# EAGLE design G503 (EAGLE 6.6.0)

## Sheet 1 of 2
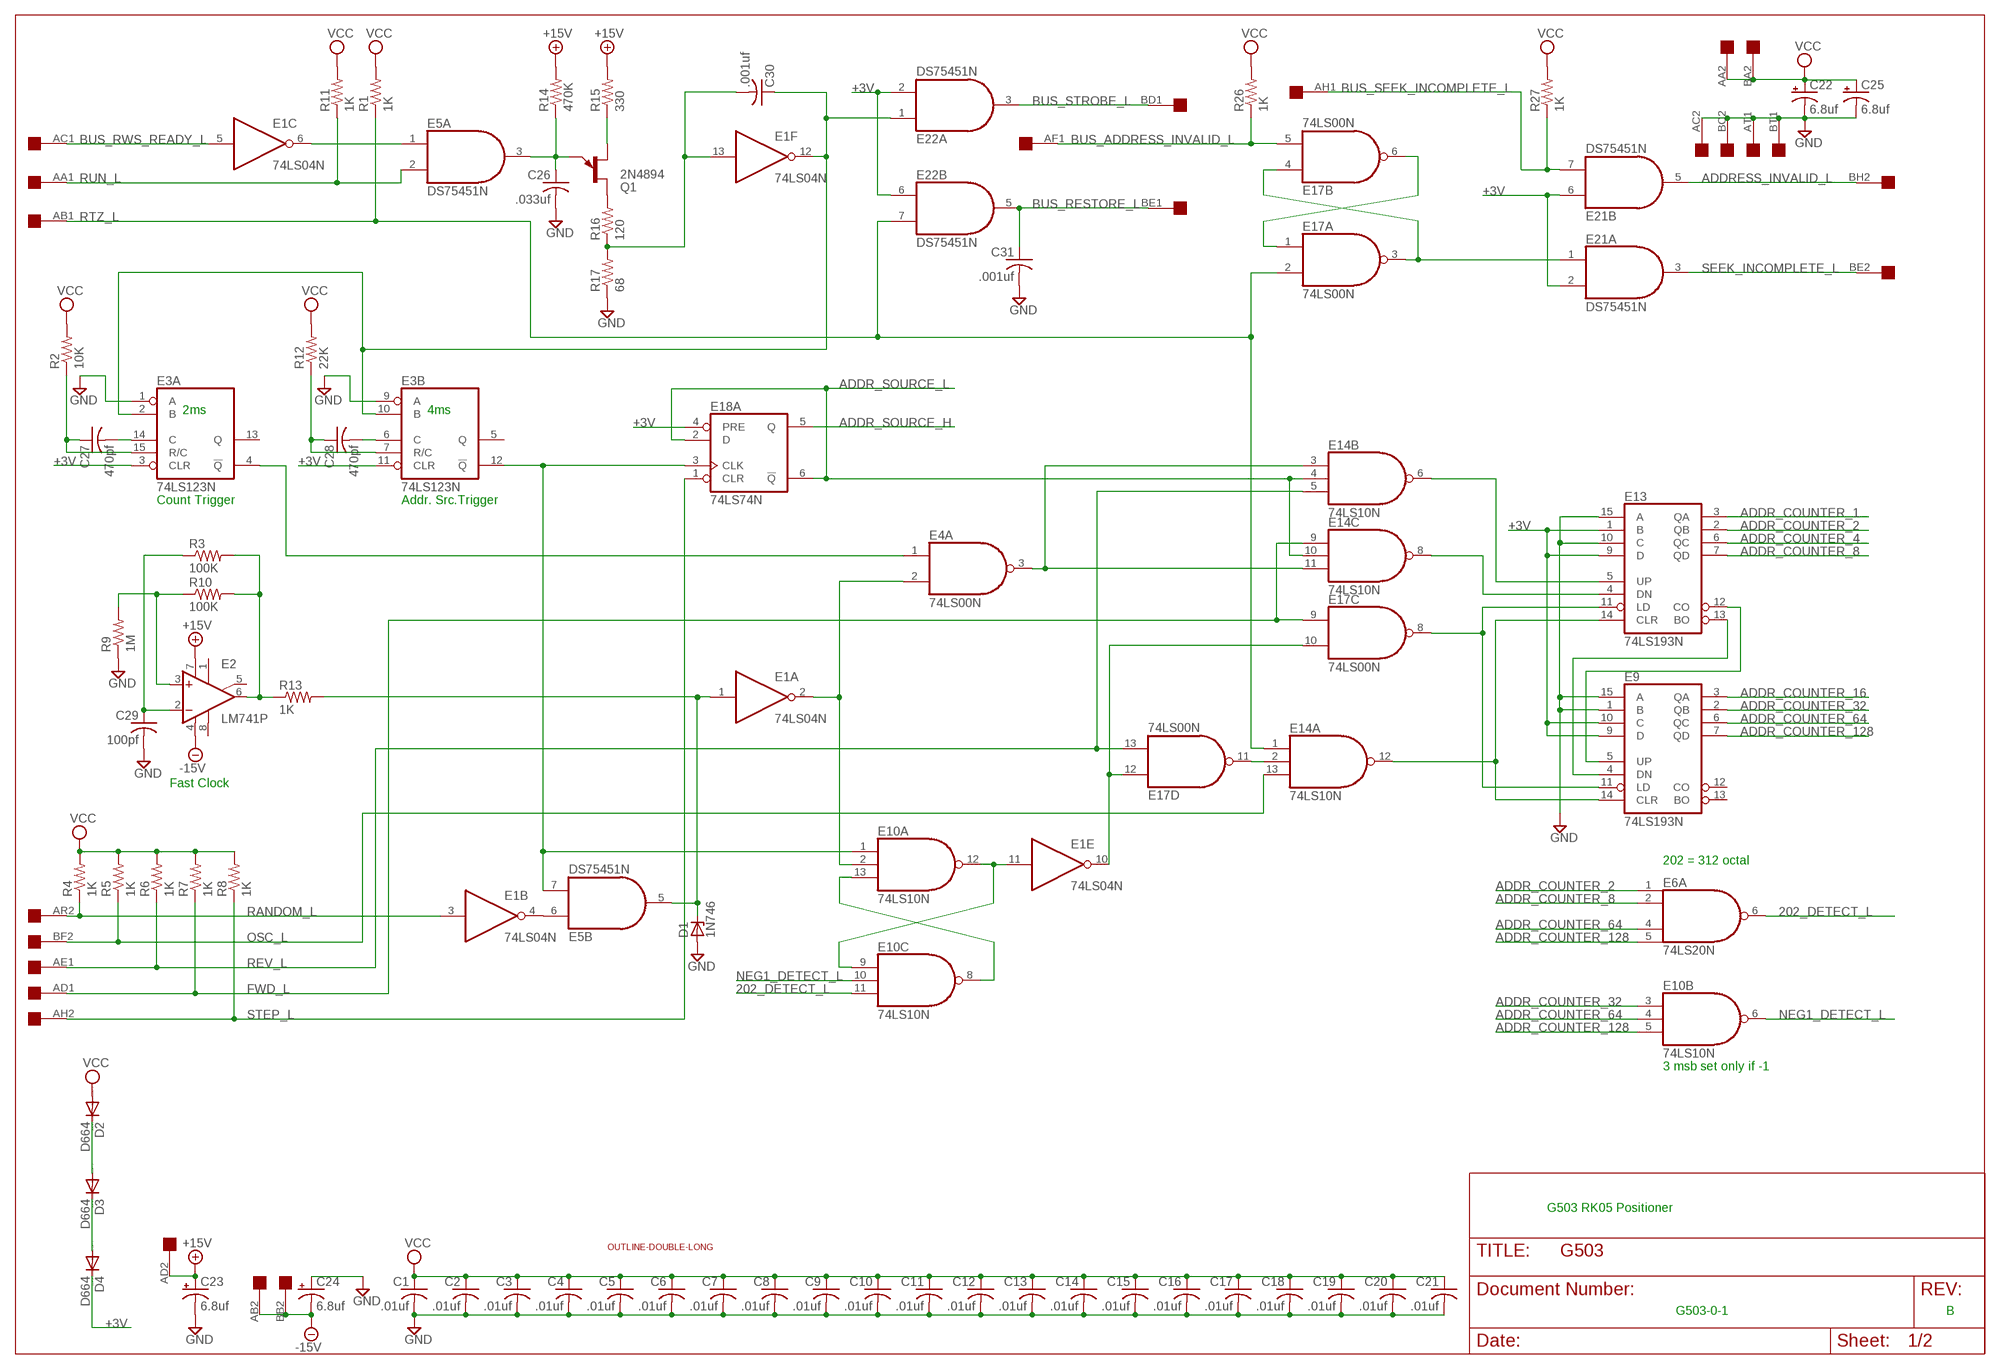
[diagram p0: schematic, sheet 1]

### Parts
AB03  DOUBLE  [EDGE-CON4]
C1  .01uf  C-US075-032X103  [C075-032X103]
C2  .01uf  C-US075-032X103  [C075-032X103]
C3  .01uf  C-US075-032X103  [C075-032X103]
C4  .01uf  C-US075-032X103  [C075-032X103]
C5  .01uf  C-US075-032X103  [C075-032X103]
C6  .01uf  C-US075-032X103  [C075-032X103]
C7  .01uf  C-US075-032X103  [C075-032X103]
C8  .01uf  C-US075-032X103  [C075-032X103]
C9  .01uf  C-US075-032X103  [C075-032X103]
C10  .01uf  C-US075-032X103  [C075-032X103]
C11  .01uf  C-US075-032X103  [C075-032X103]
C12  .01uf  C-US075-032X103  [C075-032X103]
C13  .01uf  C-US075-032X103  [C075-032X103]
C14  .01uf  C-US075-032X103  [C075-032X103]
C15  .01uf  C-US075-032X103  [C075-032X103]
C16  .01uf  C-US075-032X103  [C075-032X103]
C17  .01uf  C-US075-032X103  [C075-032X103]
C18  .01uf  C-US075-032X103  [C075-032X103]
C19  .01uf  C-US075-032X103  [C075-032X103]
C20  .01uf  C-US075-032X103  [C075-032X103]
C21  .01uf  C-US075-032X103  [C075-032X103]
C22  6.8uf  CPOL-USE25-9AXIAL  [E25-9]
C23  6.8uf  CPOL-USE25-9AXIAL  [E25-9]
C24  6.8uf  CPOL-USE25-9AXIAL  [E25-9]
C25  6.8uf  CPOL-USE25-9AXIAL  [E25-9]
C26  .033uf  C-US075-032X103  [C075-032X103]
C27  470pf  C-US075-032X103  [C075-032X103]
C28  470pf  C-US075-032X103  [C075-032X103]
C29  100pf  C-US075-032X103  [C075-032X103]
C30  .001uf  C-US075-032X103  [C075-032X103]
C31  .001uf  C-US075-032X103  [C075-032X103]
D1  1N746  ZENER-DIODEDO35Z10  [DO35Z10]
D2  D664  1N4148DO35-10  [DO35-10]
D3  D664  1N4148DO35-10  [DO35-10]
D4  D664  1N4148DO35-10  [DO35-10]
E1  74LS04N  [DIL14]
E2  LM741P  [DIL08]
E3  74LS123N  [DIL16]
E4  74LS00N  [DIL14]
E5  DS75451N  [DIL08]
E6  74LS20N  [DIL14]
E9  74LS193N  [DIL16]
E10  74LS10N  74AS10N  [DIL14]
E13  74LS193N  [DIL16]
E14  74LS10N  74AS10N  [DIL14]
E17  74LS00N  [DIL14]
E18  74LS74N  [DIL14]
E21  DS75451N  [DIL08]
E22  DS75451N  [DIL08]
Q1  2N4894  2N4870  [TO92E]
R1  1K  R-US_0207/10  [0207/10]
R2  10K  R-US_0207/10  [0207/10]
R3  100K  R-US_0207/10  [0207/10]
R4  1K  R-US_0207/10  [0207/10]
R5  1K  R-US_0207/10  [0207/10]
R6  1K  R-US_0207/10  [0207/10]
R7  1K  R-US_0207/10  [0207/10]
R8  1K  R-US_0207/10  [0207/10]
R9  1M  R-US_0207/10  [0207/10]
R10  100K  R-US_0207/10  [0207/10]
R11  1K  R-US_0207/10  [0207/10]
R12  22K  R-US_0207/10  [0207/10]
R13  1K  R-US_0207/10  [0207/10]
R14  470K  R-US_0207/10  [0207/10]
R15  330  R-US_0207/10  [0207/10]
R16  120  R-US_0207/10  [0207/10]
R17  68  R-US_0207/10  [0207/10]
R26  1K  R-US_0207/10  [0207/10]
R27  1K  R-US_0207/10  [0207/10]
U$1  OUTLINE-DOUBLE-LONG  [DOUBLE-LONG]

### Nets
202_DETECT_L: E6.6(A:O) E10.11(C:I2)
+3V: D4.C E3.3(A:CLR) E3.11(B:CLR) E9.9(D) E9.10(C) E13.1(B) E13.9(D) E18.4(A:PRE) E21.2(A:I1) E21.6(B:I0) E22.2(A:I1) E22.6(B:I0)
+15V: AB03.AD2 C23.+ E2.7(V+) R14.2 R15.2
-15V: AB03.AB2 AB03.BB2 C24.- E2.4(V-)
ADDR_COUNTER_1: E13.3(QA) ; also sheet 2
ADDR_COUNTER_2: E6.1(A:I0) E13.2(QB) ; also sheet 2
ADDR_COUNTER_4: E13.6(QC) ; also sheet 2
ADDR_COUNTER_8: E6.2(A:I1) E13.7(QD) ; also sheet 2
ADDR_COUNTER_16: E9.3(QA) ; also sheet 2
ADDR_COUNTER_32: E9.2(QB) E10.3(B:I0) ; also sheet 2
ADDR_COUNTER_64: E6.4(A:I2) E9.6(QC) E10.4(B:I1) ; also sheet 2
ADDR_COUNTER_128: E6.5(A:I3) E9.7(QD) E10.5(B:I2) ; also sheet 2
ADDR_SOURCE_H: E18.5(A:Q) ; also sheet 2
ADDR_SOURCE_L: E14.4(B:I1) E14.10(C:I1) E18.2(A:D) E18.6(A:!Q) ; also sheet 2
ADDRESS_INVALID_L: AB03.BH2 E21.5(B:O)
BUS_ADDRESS_INVALID_L: AB03.AF1 E17.5(B:I1) R26.1
BUS_RESTORE_L: AB03.BE1 C31.1 E22.5(B:O)
BUS_RWS_READY_L: AB03.AC1 E1.5(C:I)
BUS_SEEK_INCOMPLETE_L: AB03.AH1 E21.7(B:I1) R27.1
BUS_STROBE_L: AB03.BD1 E22.3(A:O)
FWD_L: AB03.AD1 E14.9(C:I0) E17.9(C:I0) R7.1
GND: AB03.AC2 AB03.AT1 AB03.BC2 AB03.BT1 C1.2 C2.2 C3.2 C4.2 C5.2 C6.2 C7.2 C8.2 C9.2 C10.2 C11.2 C12.2 C13.2 C14.2 C15.2 C16.2 C17.2 C18.2 C19.2 C20.2 C21.2 C22.- C23.- C24.+ C25.- C26.2 C29.2 C31.2 D1.A E3.1(A:A) E3.9(B:A) E9.1(B) E9.15(A) E13.10(C) E13.15(A) R9.1 R17.1 ; also sheet 2
N$1: E1.6(C:O) E5.1(A:I0)
N$2: C26.1 E5.3(A:O) Q1.E R14.1
N$3: Q1.B1 R15.1
N$4: Q1.B2 R16.2
N$5: C30.2 E1.13(F:I) R16.1 R17.2
N$6: C30.1 E1.12(F:O) E3.2(A:B) E3.10(B:B) E22.1(A:I0)
N$7: E17.1(A:I0) E17.6(B:O)
N$8: E17.3(A:O) E17.4(B:I0) E21.1(A:I0)
N$9: C27.1 E3.15(A:R/C) R2.1
N$10: C27.2 E3.14(A:C)
N$11: C28.1 E3.7(B:R/C) R12.1
N$12: C28.2 E3.6(B:C)
N$29: E13.5(UP) E14.6(B:O)
N$30: E9.4(DN) E13.13(BO)
N$31: E9.5(UP) E13.12(CO)
N$32: E13.4(DN) E14.8(C:O)
N$33: E9.11(LD) E13.11(LD) E17.8(C:O)
N$34: E9.14(CLR) E13.14(CLR) E14.12(A:O)
N$35: C29.1 E2.2(-IN) R3.1
N$36: E2.6(OUT) R3.2 R10.2 R13.1
N$37: E2.3(+IN) R9.2 R10.1
N$38: D1.C E1.1(A:I) E5.5(B:O) R13.2
N$39: E1.2(A:O) E4.2(A:I1) E10.2(A:I1)
N$40: E3.4(A:!Q) E4.1(A:I0)
N$41: D2.C D3.A
N$42: D3.C D4.A
N$44: E1.4(B:O) E5.6(B:I0)
N$45: E10.8(C:O) E10.13(A:I2)
N$46: E3.12(B:!Q) E5.7(B:I1) E10.1(A:I0) E18.3(A:CLK)
N$47: E4.3(A:O) E14.3(B:I0) E14.11(C:I2)
N$48: E1.11(E:I) E10.9(C:I0) E10.12(A:O)
N$49: E14.2(A:I1) E17.11(D:O)
N$50: E1.10(E:O) E17.10(C:I1) E17.12(D:I0)
NEG1_DETECT_L: E10.6(B:O) E10.10(C:I1)
OSC_L: AB03.BF2 E14.13(A:I2) R5.1
RANDOM_L: AB03.AR2 E1.3(B:I) R4.1
REV_L: AB03.AE1 E14.5(B:I2) E17.13(D:I1) R6.1
RTZ_L: AB03.AB1 E14.1(A:I0) E17.2(A:I1) E22.7(B:I1) R1.1
RUN_L: AB03.AA1 E5.2(A:I1) R11.1
SEEK_INCOMPLETE_L: AB03.BE2 E21.3(A:O)
STEP_L: AB03.AH2 E18.1(A:CLR) R8.1
VCC: AB03.AA2 AB03.BA2 C1.1 C2.1 C3.1 C4.1 C5.1 C6.1 C7.1 C8.1 C9.1 C10.1 C11.1 C12.1 C13.1 C14.1 C15.1 C16.1 C17.1 C18.1 C19.1 C20.1 C21.1 C22.+ C25.+ D2.A R1.2 R2.2 R4.2 R5.2 R6.2 R7.2 R8.2 R11.2 R12.2 R26.2 R27.2 ; also sheet 2
Unconnected: AB03.AE2 AB03.AF2 AB03.AJ1 AB03.AJ2 AB03.AK1 AB03.AK2 AB03.AL2 AB03.AM2 AB03.AN2 AB03.AP2 AB03.AS2 AB03.AT2 AB03.AU2 AB03.AV2 AB03.BA1 AB03.BB1 AB03.BC1 AB03.BD2 AB03.BJ2 AB03.BK2 AB03.BL2 AB03.BM2 AB03.BN2 AB03.BP2 AB03.BR1 AB03.BR2 AB03.BS1 AB03.BS2 AB03.BT2 AB03.BU1 AB03.BU2 AB03.BV1 AB03.BV2 E2.1(ON1) E2.5(ON2) E2.8(OPT) E3.5(B:Q) E3.13(A:Q) E9.12(CO) E9.13(BO)

### Notes on the sheet
- 2ms | 4ms
- Count Trigger | Addr. Src.Trigger
- Fast Clock
- 202 = 312 octal
- 3 msb set only if -1
- G503 RK05 Positioner
- G503-0-1 | B

## Sheet 2 of 2
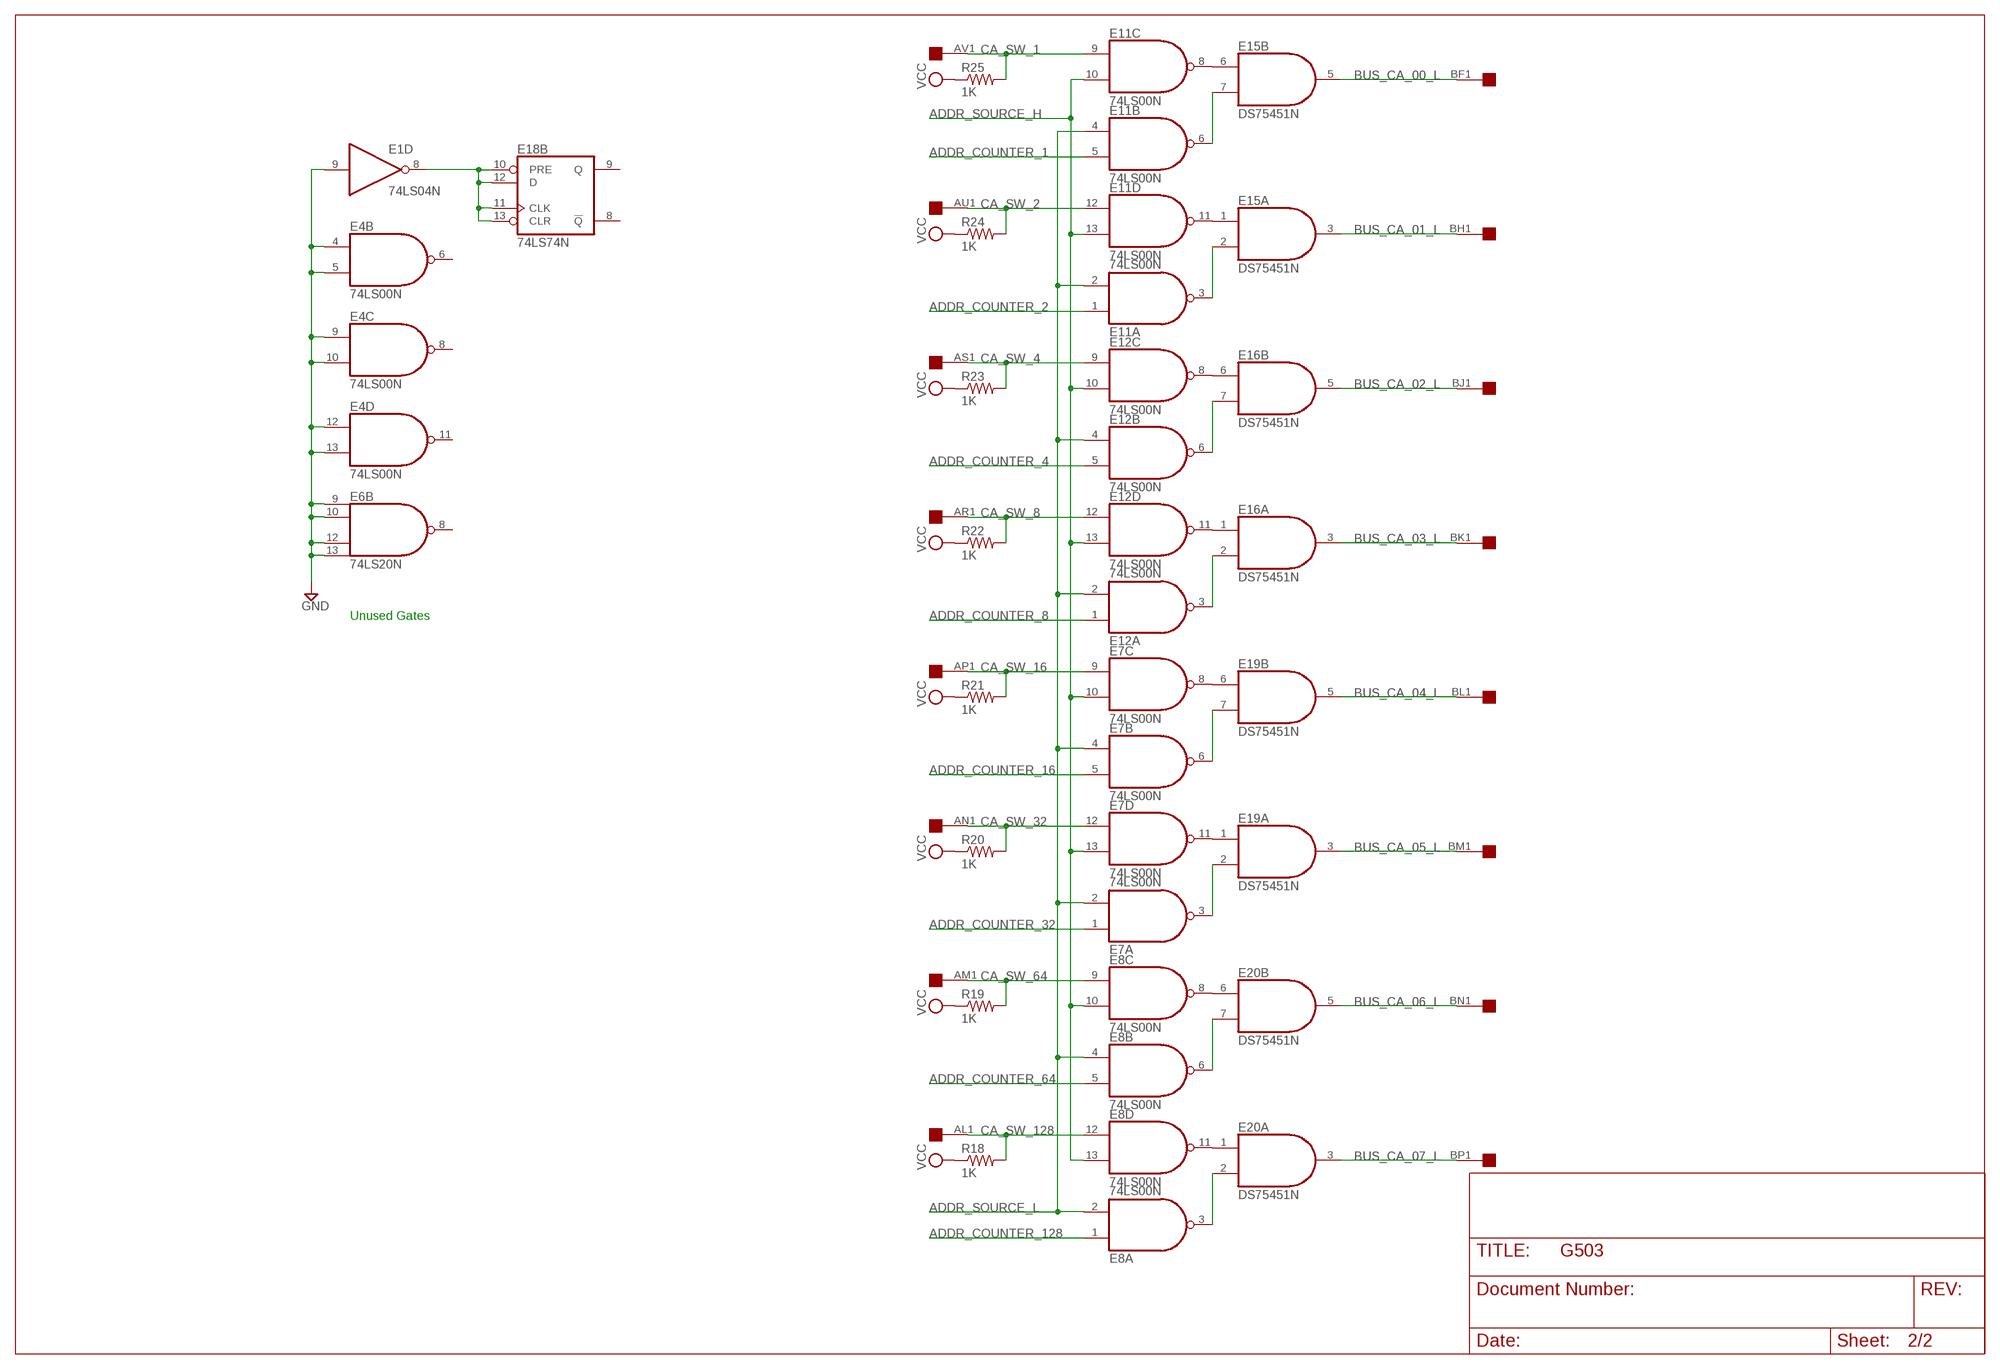
[diagram p1: schematic, sheet 2]

### Parts
E7  74LS00N  [DIL14]
E8  74LS00N  [DIL14]
E11  74LS00N  [DIL14]
E12  74LS00N  [DIL14]
E15  DS75451N  [DIL08]
E16  DS75451N  [DIL08]
E19  DS75451N  [DIL08]
E20  DS75451N  [DIL08]
R18  1K  R-US_0207/10  [0207/10]
R19  1K  R-US_0207/10  [0207/10]
R20  1K  R-US_0207/10  [0207/10]
R21  1K  R-US_0207/10  [0207/10]
R22  1K  R-US_0207/10  [0207/10]
R23  1K  R-US_0207/10  [0207/10]
R24  1K  R-US_0207/10  [0207/10]
R25  1K  R-US_0207/10  [0207/10]

### Nets
ADDR_COUNTER_1: E11.5(B:I1) ; also sheet 1
ADDR_COUNTER_2: E11.1(A:I0) ; also sheet 1
ADDR_COUNTER_4: E12.5(B:I1) ; also sheet 1
ADDR_COUNTER_8: E12.1(A:I0) ; also sheet 1
ADDR_COUNTER_16: E7.5(B:I1) ; also sheet 1
ADDR_COUNTER_32: E7.1(A:I0) ; also sheet 1
ADDR_COUNTER_64: E8.5(B:I1) ; also sheet 1
ADDR_COUNTER_128: E8.1(A:I0) ; also sheet 1
ADDR_SOURCE_H: E7.10(C:I1) E7.13(D:I1) E8.10(C:I1) E8.13(D:I1) E11.10(C:I1) E11.13(D:I1) E12.10(C:I1) E12.13(D:I1) ; also sheet 1
ADDR_SOURCE_L: E7.2(A:I1) E7.4(B:I0) E8.2(A:I1) E8.4(B:I0) E11.2(A:I1) E11.4(B:I0) E12.2(A:I1) E12.4(B:I0) ; also sheet 1
BUS_CA_00_L: AB03.BF1 E15.5(B:O)
BUS_CA_01_L: AB03.BH1 E15.3(A:O)
BUS_CA_02_L: AB03.BJ1 E16.5(B:O)
BUS_CA_03_L: AB03.BK1 E16.3(A:O)
BUS_CA_04_L: AB03.BL1 E19.5(B:O)
BUS_CA_05_L: AB03.BM1 E19.3(A:O)
BUS_CA_06_L: AB03.BN1 E20.5(B:O)
BUS_CA_07_L: AB03.BP1 E20.3(A:O)
CA_SW_1: AB03.AV1 E11.9(C:I0) R25.2
CA_SW_2: AB03.AU1 E11.12(D:I0) R24.2
CA_SW_4: AB03.AS1 E12.9(C:I0) R23.2
CA_SW_8: AB03.AR1 E12.12(D:I0) R22.2
CA_SW_16: AB03.AP1 E7.9(C:I0) R21.2
CA_SW_32: AB03.AN1 E7.12(D:I0) R20.2
CA_SW_64: AB03.AM1 E8.9(C:I0) R19.2
CA_SW_128: AB03.AL1 E8.12(D:I0) R18.2
GND: E1.9(D:I) E4.4(B:I0) E4.5(B:I1) E4.9(C:I0) E4.10(C:I1) E4.12(D:I0) E4.13(D:I1) E6.9(B:I0) E6.10(B:I1) E6.12(B:I2) E6.13(B:I3) ; also sheet 1
N$13: E11.6(B:O) E15.7(B:I1)
N$14: E11.8(C:O) E15.6(B:I0)
N$15: E11.3(A:O) E15.2(A:I1)
N$16: E11.11(D:O) E15.1(A:I0)
N$17: E12.8(C:O) E16.6(B:I0)
N$18: E12.6(B:O) E16.7(B:I1)
N$19: E12.11(D:O) E16.1(A:I0)
N$20: E12.3(A:O) E16.2(A:I1)
N$21: E7.6(B:O) E19.7(B:I1)
N$22: E7.3(A:O) E19.2(A:I1)
N$23: E8.6(B:O) E20.7(B:I1)
N$24: E8.3(A:O) E20.2(A:I1)
N$25: E8.11(D:O) E20.1(A:I0)
N$26: E8.8(C:O) E20.6(B:I0)
N$27: E7.11(D:O) E19.1(A:I0)
N$28: E7.8(C:O) E19.6(B:I0)
N$43: E1.8(D:O) E18.10(B:PRE) E18.11(B:CLK) E18.12(B:D) E18.13(B:CLR)
VCC: R18.1 R19.1 R20.1 R21.1 R22.1 R23.1 R24.1 R25.1 ; also sheet 1
Unconnected: E4.6(B:O) E4.8(C:O) E4.11(D:O) E6.8(B:O) E18.8(B:!Q) E18.9(B:Q)

### Notes on the sheet
- Unused Gates

## Power pins joined to a net without a drawn wire
GND: E1.7(P:GND) E3.8(P:GND) E4.7(P:GND) E5.4(PWR:GND) E6.7(P:GND) E7.7(P:GND) E8.7(P:GND) E9.8(GND) E10.7(P:GND) E11.7(P:GND) E12.7(P:GND) E13.8(GND) E14.7(P:GND) E15.4(PWR:GND) E16.4(PWR:GND) E17.7(P:GND) E18.7(P:GND) E19.4(PWR:GND) E20.4(PWR:GND) E21.4(PWR:GND) E22.4(PWR:GND)
VCC: E1.14(P:VCC) E3.16(P:VCC) E4.14(P:VCC) E5.8(PWR:VCC) E6.14(P:VCC) E7.14(P:VCC) E8.14(P:VCC) E9.16(VCC) E10.14(P:VCC) E11.14(P:VCC) E12.14(P:VCC) E13.16(VCC) E14.14(P:VCC) E15.8(PWR:VCC) E16.8(PWR:VCC) E17.14(P:VCC) E18.14(P:VCC) E19.8(PWR:VCC) E20.8(PWR:VCC) E21.8(PWR:VCC) E22.8(PWR:VCC)

## Library data of the parts
AB03 = dec-con:DOUBLE: Double-Height DEC board
C1-C21 C26-C31 = rcl:C-US: CAPACITOR, American symbol
C22-C25 = rcl:CPOL-US: POLARIZED CAPACITOR, American symbol
D1 = diode:ZENER-DIODE: Z-Diode
D2-D4 = diode:1N4148: DIODE high speed (Philips)
E1 = 74xx-us:74*04: Hex INVERTER
E2 = linear:*741: OP AMP
E3 = 74xx-us:74*123: Retriggerable monostable MULTIVIBRATOR
E4 E7 E8 E11 E12 E17 = 74xx-us:74*00: Quad 2-input NAND gate
E5 E15 E16 E19-E22 = dec-con:DS75451
E6 = 74xx-us:74*20: Dual 4-input NAND gate
E9 E13 = dec-con:74*193: Synchronous 4-bit UP/DOWN COUNTER
E10 E14 = 74xx-us:74*10: Triple 3-input NAND gate
E18 = 74xx-us:74*74: Dual D type positive edge triggered FLIP FLOP, preset and clear
Q1 = transistor-small-signal:2N4870: UNIJUNCTION TRANSISTOR
R1-R27 = rcl:R-US_: RESISTOR, American symbol
U$1 = dec-con:OUTLINE-*: Board outlines for DEC boards.

## Net classes
0 default: width 0.508 mm

## Board
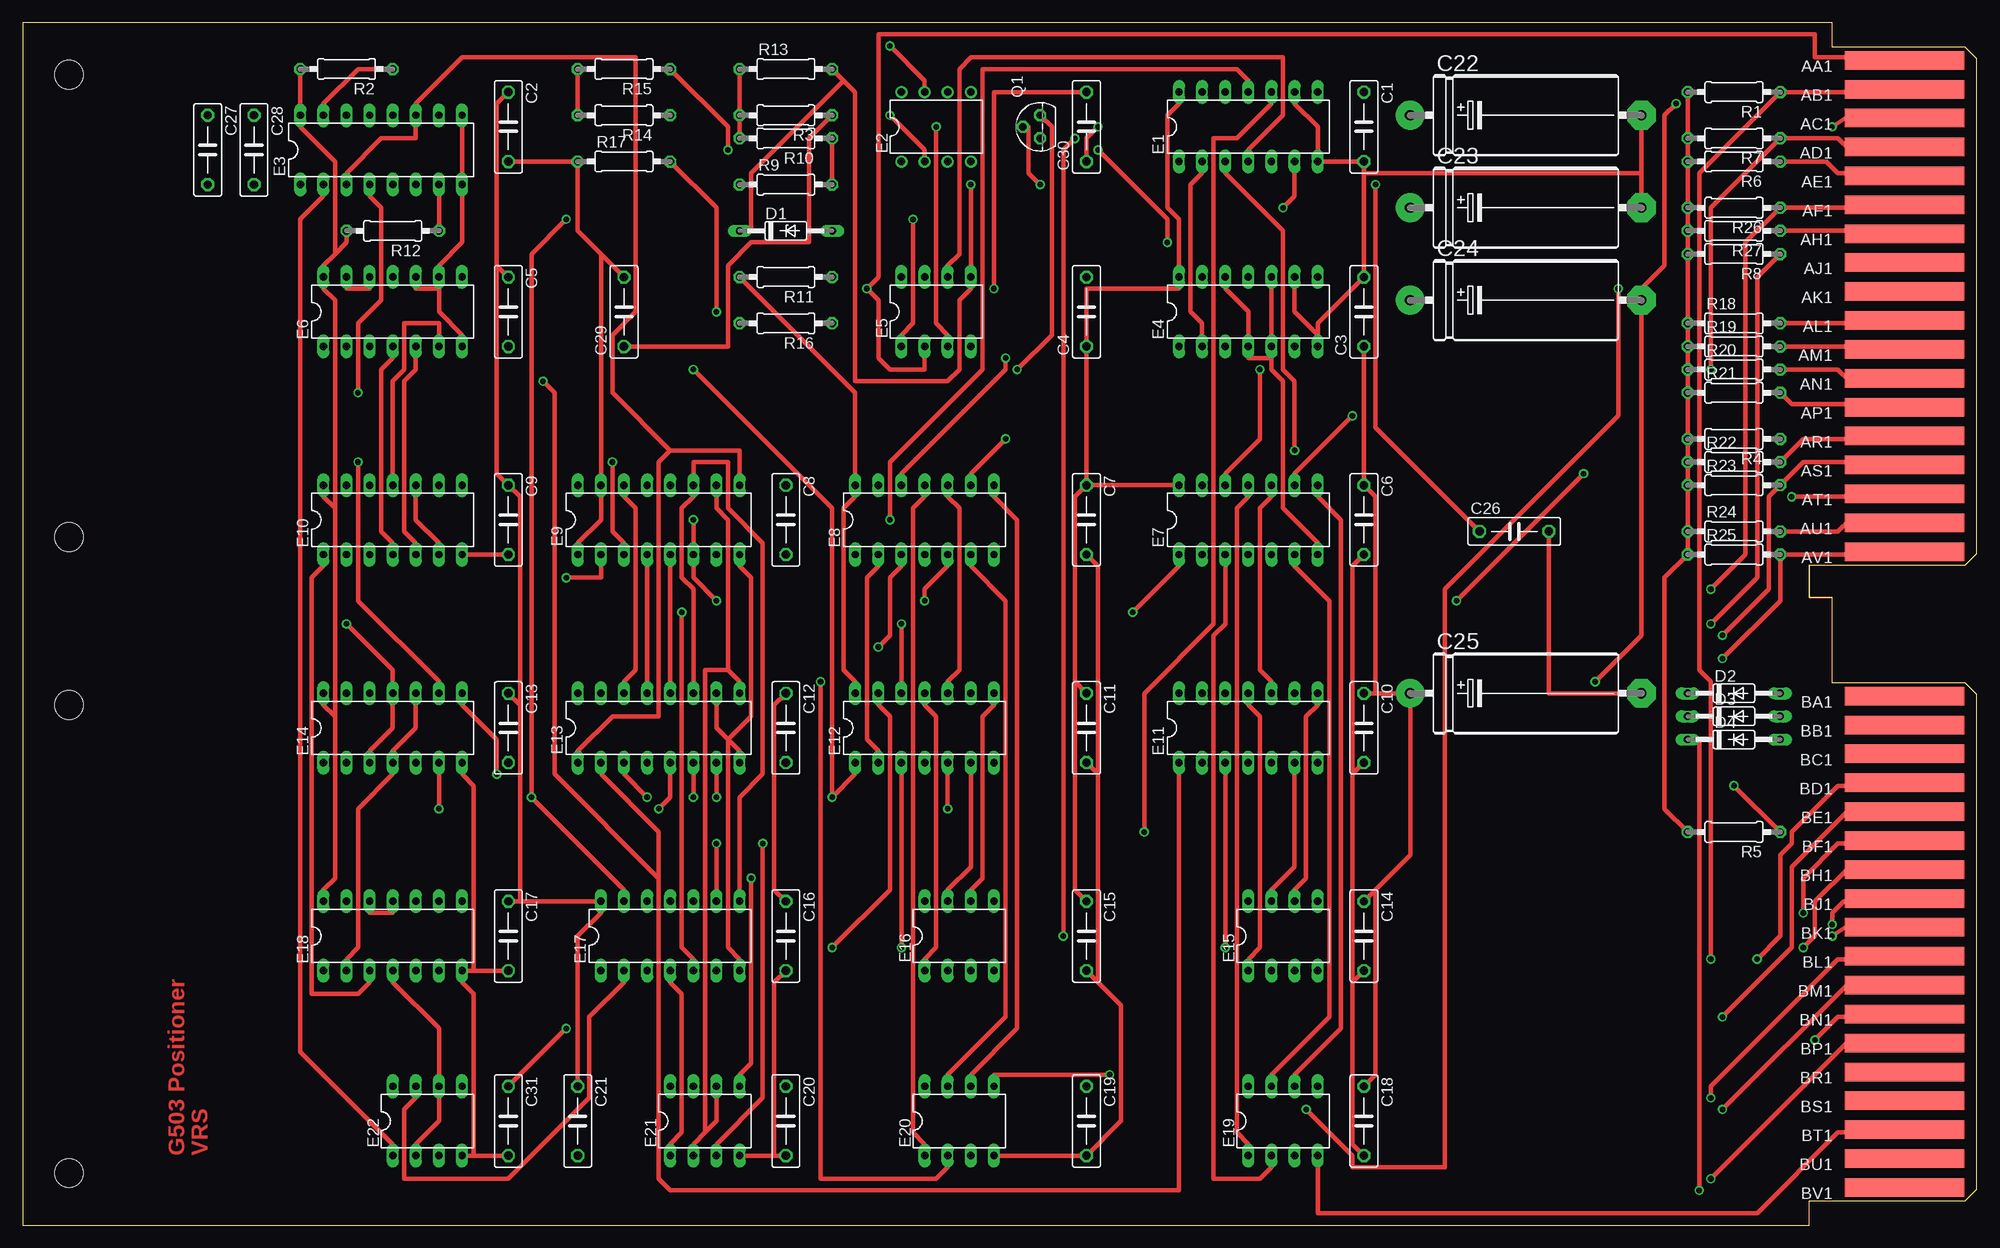
[diagram p2: board, top side]
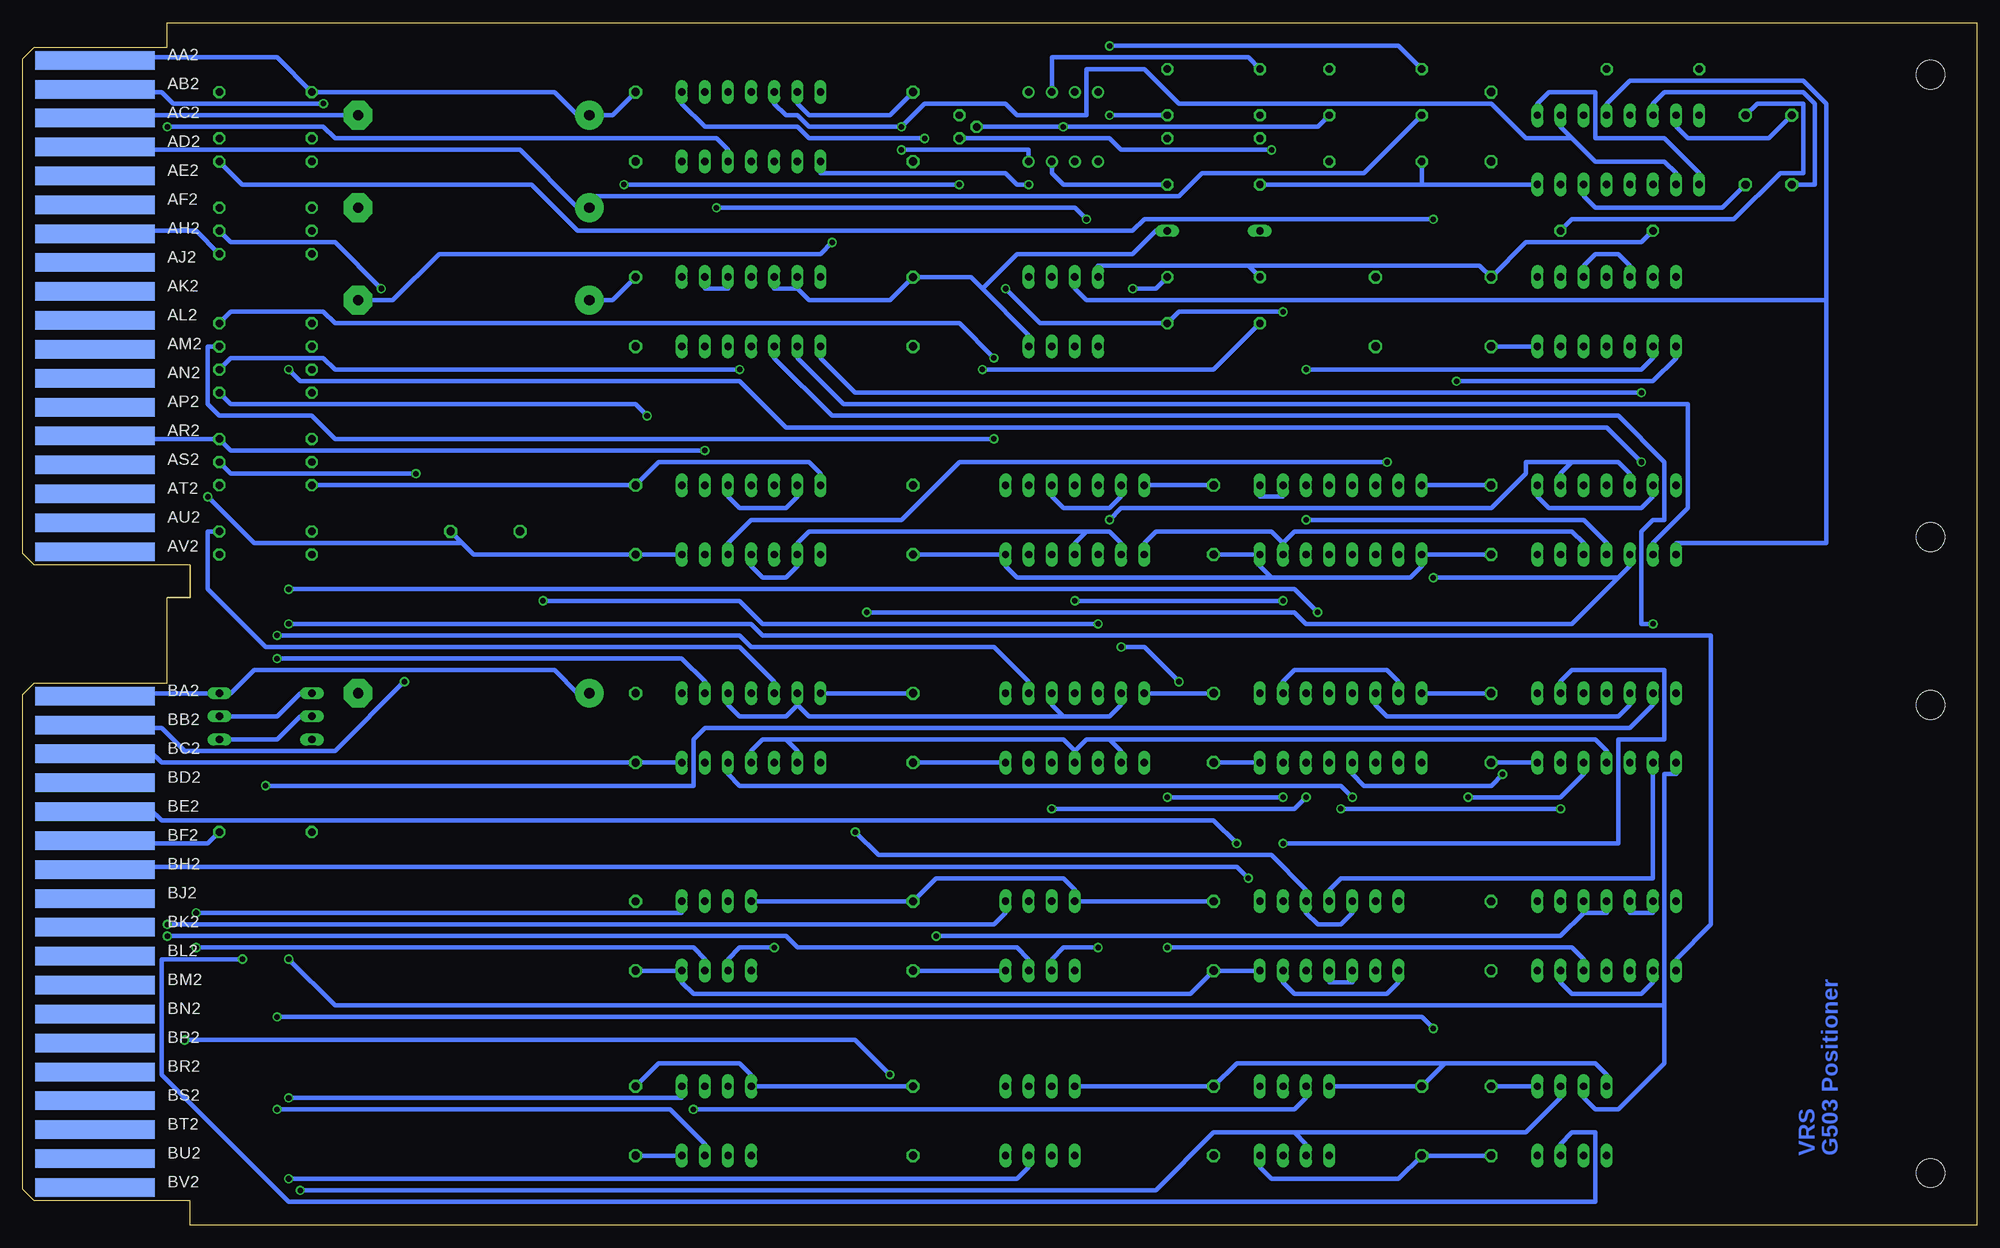
[diagram p3: board, bottom side, seen from below]

Size 214.63 x 132.08 mm. Coordinates in mm from the lower left corner, seen from the top.
Copper layers (1*16): Top 0.035mm / dielectric 1.5mm / Bottom 0.035mm
Design rules "10mils *": minimum track width 10mil, minimum drill 24mil, track to track 10mil, track to pad 10mil, pad to pad 10mil, via to via 10mil, smd to smd 10mil, copper to edge 15mil, drill to drill 10mil, minimum pad ring 10mil, minimum via ring 8mil, stop-mask expansion 0mil, vias tented up to drill 0mil, thermal gap 10mil

### Footprints (pad centres in the part's own frame; a part is rotated, then mirrored left to right if it is on the bottom)
EDGE-CON4 = smd 13.106 x 2.032: AA1 7.938,4.128; AB1 7.938,7.303; AC1 7.938,10.477; AD1 7.938,13.652; AE1 7.938,16.828; AF1 7.938,20.003; AH1 7.938,23.177; AJ1 7.938,26.352; AK1 7.938,29.527; AL1 7.938,32.703; AM1 7.938,35.877; AN1 7.938,39.053; AP1 7.938,42.227; AR1 7.938,45.403; AS1 7.938,48.578; AT1 7.938,51.752; AU1 7.938,54.928; AV1 7.938,58.102; BA1 7.938,73.978; BB1 7.938,77.153; BC1 7.938,80.328; BD1 7.938,83.502; BE1 7.938,86.677; BF1 7.938,89.853; BH1 7.938,93.028; BJ1 7.938,96.203; BK1 7.938,99.377; BL1 7.938,102.552; BM1 7.938,105.728; BN1 7.938,108.903; BP1 7.938,112.078; BR1 7.938,115.252; BS1 7.938,118.427; BT1 7.938,121.603; BU1 7.938,124.778; BV1 7.938,127.953 | smd 13.106 x 2.032 bottom: AA2 7.938,4.128; AB2 7.938,7.303; AC2 7.938,10.477; AD2 7.938,13.652; AE2 7.938,16.828; AF2 7.938,20.003; AH2 7.938,23.177; AJ2 7.938,26.352; AK2 7.938,29.527; AL2 7.938,32.703; AM2 7.938,35.877; AN2 7.938,39.053; AP2 7.938,42.227; AR2 7.938,45.403; AS2 7.938,48.578; AT2 7.938,51.752; AU2 7.938,54.928; AV2 7.938,58.102; BA2 7.938,73.978; BB2 7.938,77.153; BC2 7.938,80.328; BD2 7.938,83.502; BE2 7.938,86.677; BF2 7.938,89.853; BH2 7.938,93.028; BJ2 7.938,96.203; BK2 7.938,99.377; BL2 7.938,102.552; BM2 7.938,105.728; BN2 7.938,108.903; BP2 7.938,112.078; BR2 7.938,115.252; BS2 7.938,118.427; BT2 7.938,121.603; BU2 7.938,124.778; BV2 7.938,127.953
C075-032X103 = drill 0.914 octagon: 1 -3.81,0; 2 3.81,0
E25-9 = drill 1.118 pad 3.15: + -12.7,0 | drill 1.118 pad 3.15 octagon: - 12.7,0
DO35Z10 = drill 0.813 long: A 5.08,0; C -5.08,0
DO35-10 = drill 0.813 long: A 5.08,0; C -5.08,0
DIL14 = drill 0.813 long: 1 -7.62,-3.81; 2 -5.08,-3.81; 3 -2.54,-3.81; 4 0,-3.81; 5 2.54,-3.81; 6 5.08,-3.81; 7 7.62,-3.81; 8 7.62,3.81; 9 5.08,3.81; 10 2.54,3.81; 11 0,3.81; 12 -2.54,3.81; 13 -5.08,3.81; 14 -7.62,3.81
DIL08 = drill 0.813 pad 1.27: 1 -3.81,-3.81; 2 -1.27,-3.81; 3 1.27,-3.81; 4 3.81,-3.81; 5 3.81,3.81; 6 1.27,3.81; 7 -1.27,3.81; 8 -3.81,3.81
DIL16 = drill 0.813 long: 1 -8.89,-3.81; 2 -6.35,-3.81; 3 -3.81,-3.81; 4 -1.27,-3.81; 5 1.27,-3.81; 6 3.81,-3.81; 7 6.35,-3.81; 8 8.89,-3.81; 9 8.89,3.81; 10 6.35,3.81; 11 3.81,3.81; 12 1.27,3.81; 13 -1.27,3.81; 14 -3.81,3.81; 15 -6.35,3.81; 16 -8.89,3.81
DIL08' = drill 0.813 long: 1 -3.81,-3.81; 2 -1.27,-3.81; 3 1.27,-3.81; 4 3.81,-3.81; 5 3.81,3.81; 6 1.27,3.81; 7 -1.27,3.81; 8 -3.81,3.81
TO92E = drill 0.813 octagon: B1 -1.27,0; B2 1.27,0; E 0,1.905
0207/10 = drill 0.813 octagon: 1 -5.08,0; 2 5.08,0
DOUBLE-LONG = hole 3.175: 209.55,56.515; 209.55,5.715; 209.55,74.93; 209.55,126.365

### Placement (x,y rotation side)
AB03  214.63,132.08 180 top
C1  147.32,120.65 270 top
C2  53.34,120.65 270 top
C3  147.32,100.33 90 top
C4  116.84,100.33 90 top
C5  53.34,100.33 270 top
C6  147.32,77.47 270 top
C7  116.84,77.47 270 top
C8  83.82,77.47 270 top
C9  53.34,77.47 270 top
C10  147.32,54.61 270 top
C11  116.84,54.61 270 top
C12  83.82,54.61 270 top
C13  53.34,54.61 270 top
C14  147.32,31.75 270 top
C15  116.84,31.75 270 top
C16  83.82,31.75 270 top
C17  53.34,31.75 270 top
C18  147.32,11.43 270 top
C19  116.84,11.43 270 top
C20  83.82,11.43 270 top
C21  60.96,11.43 270 top
C22  165.1,121.92 0 top
C23  165.1,111.76 0 top
C24  165.1,101.6 0 top
C25  165.1,58.42 0 top
C26  163.83,76.2 0 top
C27  20.32,118.11 270 top
C28  25.4,118.11 270 top
C29  66.04,100.33 90 top
C30  116.84,120.65 90 top
C31  53.34,11.43 270 top
D1  83.82,109.22 0 top
D2  187.96,58.42 0 top
D3  187.96,55.88 0 top
D4  187.96,53.34 0 top
E1  134.62,120.65 0 top
E2  100.33,120.65 0 top
E3  39.37,118.11 0 top
E4  134.62,100.33 0 top
E5  DS75451N  [DIL08']  100.33,100.33 0 top
E6  40.64,100.33 0 top
E7  134.62,77.47 0 top
E8  99.06,77.47 0 top
E9  69.85,77.47 0 top
E10  40.64,77.47 0 top
E11  134.62,54.61 0 top
E12  99.06,54.61 0 top
E13  69.85,54.61 0 top
E14  40.64,54.61 0 top
E15  DS75451N  [DIL08']  138.43,31.75 0 top
E16  DS75451N  [DIL08']  102.87,31.75 0 top
E17  71.12,31.75 0 top
E18  40.64,31.75 0 top
E19  DS75451N  [DIL08']  138.43,11.43 0 top
E20  DS75451N  [DIL08']  102.87,11.43 0 top
E21  DS75451N  [DIL08']  74.93,11.43 0 top
E22  DS75451N  [DIL08']  44.45,11.43 0 top
Q1  111.76,120.65 90 top
R1  187.96,124.46 180 top
R2  35.56,127 180 top
R3  83.82,121.92 180 top
R4  187.96,86.36 180 top
R5  187.96,43.18 180 top
R6  187.96,116.84 180 top
R7  187.96,119.38 180 top
R8  187.96,106.68 180 top
R9  83.82,114.3 0 top
R10  83.82,119.38 180 top
R11  83.82,104.14 180 top
R12  40.64,109.22 180 top
R13  83.82,127 0 top
R14  66.04,121.92 180 top
R15  66.04,127 180 top
R16  83.82,99.06 180 top
R17  66.04,116.84 0 top
R18  187.96,99.06 0 top
R19  187.96,96.52 0 top
R20  187.96,93.98 0 top
R21  187.96,91.44 0 top
R22  187.96,83.82 0 top
R23  187.96,81.28 0 top
R24  187.96,76.2 0 top
R25  187.96,73.66 0 top
R26  187.96,111.76 180 top
R27  187.96,109.22 180 top
U$1  214.63,132.08 180 top

### Tracks (layer width: path | path; a pad name or v marks a point on that pad's centre or on a via)
202_DETECT_L
  Top 0.508: E10.11 40.64,82.55 40.64,92.71 41.91,93.98 41.91,99.06 45.72,99.06 45.72,97.79 E6.6
+3V  (via drill 0.61)
  Top 0.508: E3.3 35.56,115.57 39.37,119.38 43.18,119.38 43.18,120.65 E3.11 43.18,123.19 48.26,128.27 67.31,128.27 67.31,100.33 64.77,97.79 64.77,91.44 71.12,85.09 | 71.12,85.09 69.85,83.82 69.85,55.88 64.77,55.88 60.96,52.07 E13.1 | 71.12,85.09 78.74,85.09 78.74,82.55 E9.9 | 77.47,60.96 78.74,59.69 E13.9 | 77.47,60.96 77.47,77.47 76.2,78.74 76.2,80.01 E9.10 | E22.2 43.18,8.89 45.72,11.43 45.72,13.97 E22.6 45.72,16.51 45.72,21.59 40.64,26.67 E18.4 | 74.93,10.16 76.2,11.43 76.2,13.97 E21.6 | 74.93,10.16 73.66,8.89 E21.2 | v184.15,3.81 184.15,53.34 D4.C | 77.47,60.96 74.93,60.96 74.93,10.16
  Bottom 0.508: E9.10 76.2,80.01 78.74,80.01 E9.9 | v184.15,3.81 90.17,3.81 83.82,10.16 74.93,10.16 | 74.93,10.16 73.66,8.89 E21.2 | 74.93,10.16 49.53,10.16 45.72,13.97 E22.6
+15V  (via drill 0.61)
  Top 0.508: R14.2 R15.2 | v95.25,129.54 99.06,125.73 E2.7
  Bottom 0.508: v95.25,129.54 63.5,129.54 R15.2 | AB03.AD2 200.66,118.11 160.02,118.11 153.67,111.76 C23.+ 152.4,113.03 87.63,113.03 85.09,115.57 67.31,115.57 R14.2
-15V  (via drill 0.61)
  Top 0.508: v118.11,118.11 125.73,110.49 v125.73,107.95 | v172.72,59.69 177.8,64.77 C24.- 177.8,102.87 180.34,105.41 180.34,121.92 v181.61,123.19
  Bottom 0.508: v118.11,118.11 104.14,118.11 E2.4 | v125.73,107.95 127,106.68 168.91,106.68 173.99,101.6 C24.- | v172.72,59.69 180.34,52.07 196.85,52.07 199.39,54.61 200.66,54.61 AB03.BB2 | v181.61,123.19 198.12,123.19 199.39,124.46 200.66,124.46 AB03.AB2
ADDR_COUNTER_1  (via drill 0.61)
  Top 0.508: v68.58,46.99 66.04,49.53 E13.3
  Bottom 0.508: v68.58,46.99 69.85,48.26 135.89,48.26 137.16,49.53 E11.5
ADDR_COUNTER_2  (via drill 0.61)
  Top 0.508: 69.85,38.1 69.85,5.08 71.12,3.81 127,3.81 127,49.53 E11.1 | 69.85,38.1 69.85,43.18 63.5,49.53 E13.2 | v57.15,92.71 58.42,91.44 58.42,49.53 69.85,38.1
  Bottom 0.508: v57.15,92.71 35.56,92.71 33.02,95.25 E6.1
ADDR_COUNTER_4  (via drill 0.61)
  Top 0.508: v73.66,46.99 73.66,49.53 E13.6 | v101.6,45.72 101.6,49.53 E12.5
  Bottom 0.508: v73.66,46.99 74.93,45.72 v101.6,45.72
ADDR_COUNTER_8  (via drill 0.61)
  Top 0.508: v76.2,46.99 76.2,49.53 E13.7 | E12.1 91.44,49.53 v88.9,46.99 88.9,78.74 v73.66,93.98
  Bottom 0.508: v76.2,46.99 v88.9,46.99 | v73.66,93.98 36.83,93.98 35.56,95.25 E6.2
ADDR_COUNTER_16  (via drill 0.61)
  Top 0.508: v64.77,83.82 64.77,76.2 66.04,74.93 E9.3
  Bottom 0.508: v64.77,83.82 111.76,83.82 118.11,77.47 134.62,77.47 137.16,74.93 E7.5
ADDR_COUNTER_32  (via drill 0.61)
  Top 0.508: v59.69,71.12 63.5,71.12 63.5,72.39 E9.2 | v121.92,67.31 127,72.39 E7.1
  Bottom 0.508: 39.37,71.12 38.1,72.39 E10.3 | 39.37,71.12 v59.69,71.12 | v121.92,67.31 74.93,67.31 73.66,66.04 44.45,66.04 39.37,71.12
ADDR_COUNTER_64  (via drill 0.61)
  Top 0.508: E10.4 40.64,74.93 39.37,76.2 39.37,93.98 40.64,95.25 E6.4 | v73.66,77.47 73.66,74.93 E9.6 73.66,72.39 73.66,71.12 v76.2,68.58 | v99.06,68.58 99.06,69.85 101.6,72.39 E8.5
  Bottom 0.508: v73.66,77.47 43.18,77.47 40.64,74.93 E10.4 | v76.2,68.58 v99.06,68.58
ADDR_COUNTER_128
  Top 0.508: E10.5 43.18,74.93 41.91,76.2 41.91,92.71 43.18,93.98 43.18,95.25 E6.5
  Bottom 0.508: 76.2,74.93 77.47,76.2 90.17,76.2 91.44,74.93 E8.1 | 76.2,74.93 E9.7 76.2,74.93 | 76.2,74.93 74.93,76.2 44.45,76.2 43.18,74.93 E10.5
ADDR_SOURCE_H  (via drill 0.61)
  Top 0.508: v88.9,30.48 95.25,36.83 95.25,55.88 93.98,57.15 E12.13 | E8.10 101.6,80.01 102.87,78.74 102.87,60.96 101.6,59.69 E12.10 | E7.10 137.16,80.01 135.89,78.74 135.89,60.96 137.16,59.69 E11.10
  Bottom 0.508: E7.13 129.54,80.01 130.81,78.74 135.89,78.74 137.16,80.01 E7.10 | 129.54,57.15 130.81,55.88 135.89,55.88 137.16,57.15 E11.10 | 129.54,57.15 E11.13 129.54,57.15 | E8.13 93.98,80.01 95.25,78.74 100.33,78.74 101.6,80.01 E8.10 | v88.9,30.48 44.45,30.48 43.18,29.21 E18.5 | 100.33,55.88 101.6,57.15 E12.10 | 100.33,55.88 95.25,55.88 93.98,57.15 E12.13 | 129.54,57.15 128.27,55.88 100.33,55.88
ADDR_SOURCE_L
  Top 0.508: E14.10 43.18,57.15 43.18,54.61 40.64,52.07 E14.4 40.64,49.53 36.83,45.72 36.83,30.48 35.56,29.21 E18.2 | E8.2 93.98,72.39 92.71,71.12 92.71,53.34 93.98,52.07 E12.2
  Bottom 0.508: E18.2 35.56,26.67 36.83,25.4 44.45,25.4 45.72,26.67 E18.6 | E7.4 134.62,72.39 133.35,71.12 130.81,71.12 129.54,72.39 E7.2 129.54,74.93 128.27,76.2 97.79,76.2 | 97.79,76.2 95.25,76.2 93.98,74.93 E8.2 | 97.79,76.2 99.06,74.93 E8.4 | 95.25,53.34 93.98,52.07 E12.2 | 95.25,53.34 97.79,53.34 99.06,52.07 | 99.06,52.07 E12.4 99.06,52.07 | 130.81,53.34 129.54,52.07 E11.2 | 130.81,53.34 133.35,53.34 134.62,52.07 E11.4 | 99.06,52.07 100.33,53.34 130.81,53.34 | 95.25,53.34 41.91,53.34 40.64,52.07 E14.4
ADDRESS_INVALID_L  (via drill 0.61)
  Top 0.508: v80.01,38.1 80.01,17.78 78.74,16.51 E21.5
  Bottom 0.508: v80.01,38.1 81.28,39.37 200.66,39.37 AB03.BH2
BUS_ADDRESS_INVALID_L  (via drill 0.61)
  Top 0.508: v72.39,67.31 72.39,30.48 73.66,29.21 E17.5 | v185.42,69.85 189.23,73.66 189.23,107.95 R26.1 200.66,111.76 AB03.AF1
  Bottom 0.508: v72.39,67.31 74.93,69.85 v185.42,69.85
BUS_CA_00_L  (via drill 0.61)
  Top 0.508: v195.58,34.29 195.58,38.1 199.39,41.91 200.66,41.91 AB03.BF1
  Bottom 0.508: v195.58,34.29 142.24,34.29 E15.5
BUS_CA_01_L  (via drill 0.61)
  Top 0.508: v195.58,30.48 196.85,31.75 196.85,35.56 200.66,39.37 AB03.BH1
  Bottom 0.508: v195.58,30.48 140.97,30.48 139.7,29.21 E15.3
BUS_CA_02_L  (via drill 0.61)
  Top 0.508: v198.75,33.02 198.75,34.29 200.03,35.56 200.66,35.56 AB03.BJ1
  Bottom 0.508: v198.75,33.02 107.95,33.02 106.68,34.29 E16.5
BUS_CA_03_L  (via drill 0.61)
  Top 0.508: v198.75,31.75 200.66,33.02 AB03.BK1
  Bottom 0.508: v198.75,31.75 130.81,31.75 129.54,30.48 105.41,30.48 104.14,29.21 E16.3
BUS_CA_04_L  (via drill 0.61)
  Top 0.508: v185.42,13.97 185.42,15.24 199.39,29.21 200.66,29.21 AB03.BL1
  Bottom 0.508: v185.42,13.97 142.24,13.97 E19.5
BUS_CA_05_L  (via drill 0.61)
  Top 0.508: v186.69,12.7 200.66,26.67 AB03.BM1
  Bottom 0.508: v186.69,12.7 143.51,12.7 139.7,8.89 E19.3
BUS_CA_06_L  (via drill 0.61)
  Top 0.508: v119.38,16.51 106.68,16.51 E20.5 | v196.85,20.32 199.39,22.86 200.66,22.86 AB03.BN1
  Bottom 0.508: v119.38,16.51 123.19,20.32 v196.85,20.32
BUS_CA_07_L  (via drill 0.61)
  Top 0.508: v185.42,5.08 200.66,20.32 AB03.BP1
  Bottom 0.508: v185.42,5.08 105.41,5.08 104.14,6.35 E20.3
BUS_RESTORE_L  (via drill 0.61)
  Top 0.508: C31.1 v59.69,21.59 | v186.69,22.86 194.31,30.48 194.31,39.37 200.66,45.72 AB03.BE1
  Bottom 0.508: E22.5 C31.1 | v59.69,21.59 60.96,22.86 v186.69,22.86
BUS_RWS_READY_L  (via drill 0.61)
  Top 0.508: v198.75,120.65 200.66,121.92 AB03.AC1
  Bottom 0.508: v198.75,120.65 181.61,120.65 180.34,119.38 138.43,119.38 137.16,118.11 E1.5
BUS_SEEK_INCOMPLETE_L  (via drill 0.61)
  Top 0.508: v140.97,12.7 146.05,7.62 146.05,6.35 156.21,6.35 156.21,69.85 175.26,88.9 v175.26,102.87 | R27.1 200.66,109.22 AB03.AH1
  Bottom 0.508: v140.97,12.7 74.93,12.7 73.66,13.97 E21.7 | v175.26,102.87 180.34,107.95 191.77,107.95 R27.1
BUS_STROBE_L  (via drill 0.61)
  Top 0.508: v190.5,29.21 193.04,31.75 193.04,40.64 194.31,41.91 194.31,43.18 199.39,48.26 200.66,48.26 AB03.BD1
  Bottom 0.508: v190.5,29.21 199.39,29.21 199.39,16.51 185.42,2.54 41.91,2.54 41.91,10.16 44.45,10.16 45.72,8.89 E22.3
CA_SW_1  (via drill 0.61)
  Top 0.508: v186.69,62.23 193.04,68.58 R25.2 200.66,73.66 AB03.AV1
  Bottom 0.508: v186.69,62.23 142.24,62.23 139.7,59.69 E11.9
CA_SW_2
  Top 0.508: R24.2 199.39,76.2 200.66,77.47 AB03.AU1
  Bottom 0.508: R24.2 194.31,76.2 194.31,69.85 187.96,63.5 135.89,63.5 132.08,59.69 E11.12
CA_SW_4  (via drill 0.61)
  Top 0.508: v186.69,64.77 191.77,69.85 191.77,80.01 R23.2 195.58,83.82 201.93,83.82 AB03.AS1
  Bottom 0.508: v186.69,64.77 135.89,64.77 134.62,63.5 107.95,63.5 104.14,59.69 E12.9
CA_SW_8  (via drill 0.61)
  Top 0.508: v96.52,66.04 E12.12 | v171.45,82.55 v157.48,68.58 | R22.2 195.58,86.36 200.66,86.36 AB03.AR1
  Bottom 0.508: v96.52,66.04 133.35,66.04 135.89,68.58 v157.48,68.58 | v171.45,82.55 191.77,82.55 R22.2
CA_SW_16  (via drill 0.61)
  Top 0.508: v146.05,88.9 139.7,82.55 E7.9 | R21.2 194.31,90.17 200.66,90.17 AB03.AP1
  Bottom 0.508: v146.05,88.9 147.32,90.17 191.77,90.17 R21.2
CA_SW_32  (via drill 0.61)
  Top 0.508: v135.89,93.98 135.89,86.36 132.08,82.55 E7.12 | R20.2 199.39,93.98 200.66,92.71 AB03.AN1
  Bottom 0.508: v135.89,93.98 180.34,93.98 181.61,95.25 191.77,95.25 R20.2
CA_SW_64  (via drill 0.61)
  Top 0.508: v107.95,86.36 104.14,82.55 E8.9 | R19.2 200.66,96.52 AB03.AM1
  Bottom 0.508: v107.95,86.36 180.34,86.36 182.88,88.9 193.04,88.9 194.31,90.17 194.31,96.52 R19.2
CA_SW_128  (via drill 0.61)
  Top 0.508: v107.95,95.25 107.95,93.98 96.52,82.55 E8.12 | R18.2 200.66,99.06 AB03.AL1
  Bottom 0.508: v107.95,95.25 111.76,99.06 180.34,99.06 181.61,100.33 191.77,100.33 R18.2
FWD_L  (via drill 0.61)
  Top 0.508: AB03.AD1 200.66,118.11 199.39,119.38 R7.1 185.42,111.76 v185.42,93.98 | v76.2,41.91 E17.9 | v36.83,83.82 36.83,68.58 45.72,59.69 E14.9
  Bottom 0.508: v76.2,41.91 39.37,41.91 39.37,53.34 34.29,53.34 34.29,60.96 44.45,60.96 45.72,59.69 E14.9 | v185.42,93.98 184.15,92.71 135.89,92.71 130.81,87.63 40.64,87.63 v36.83,83.82
GND  (via drill 0.61)
  Top 0.508: 49.53,27.94 C17.2 | 49.53,27.94 E18.7 48.26,26.67 49.53,25.4 49.53,7.62 | 82.55,7.62 C20.2 | 82.55,7.62 E21.4 | C31.2 49.53,7.62 | 49.53,7.62 E22.4 | C16.2 82.55,26.67 82.55,7.62 | 49.53,27.94 49.53,48.26 48.26,49.53 E14.7 | E20.4 C19.2 120.65,11.43 120.65,24.13 118.11,26.67 | 118.11,26.67 C15.2 | 118.11,49.53 C11.2 | 118.11,49.53 118.11,26.67 | C7.2 118.11,72.39 118.11,49.53 | 77.47,53.34 76.2,54.61 E13.10 | 77.47,53.34 78.74,52.07 E13.8 | C9.2 E10.7 | E9.1 60.96,74.93 63.5,77.47 E9.15 63.5,106.68 | 77.47,53.34 80.01,55.88 80.01,71.12 78.74,72.39 E9.8 | E6.13 35.56,102.87 38.1,102.87 E6.12 | 45.72,102.87 43.18,102.87 E6.10 | 45.72,102.87 45.72,100.33 48.26,97.79 E6.7 | 45.72,102.87 E6.9 45.72,105.41 48.26,107.95 E3.8 E3.9 | C2.2 R17.1 60.96,109.22 63.5,106.68 | 63.5,106.68 C29.2 | 77.47,53.34 77.47,30.48 78.74,29.21 E17.7 | C25.- 167.64,58.42 C26.2 | v194.31,80.01 200.66,80.01 AB03.AT1 | C18.2 146.05,8.89 146.05,26.67 | 146.05,26.67 C14.2 | 146.05,49.53 C10.2 | 146.05,49.53 146.05,26.67 | E19.4 142.24,1.27 190.5,1.27 199.39,10.16 200.66,10.16 AB03.BT1 | C6.2 146.05,72.39 146.05,49.53 | 177.8,115.57 C22.- | 177.8,115.57 C23.- | E1.9 139.7,123.19 142.24,120.65 E1.7 C1.2 147.32,115.57 | 137.16,95.25 134.62,95.25 E4.4 134.62,100.33 132.08,102.87 E4.12 | 142.24,97.79 139.7,100.33 E4.9 | E4.10 E4.5 137.16,95.25 | 142.24,97.79 142.24,99.06 C3.2 147.32,115.57 | 142.24,97.79 E4.7 | 147.32,115.57 177.8,115.57 | 137.16,95.25 137.16,93.98 138.43,92.71 138.43,78.74 142.24,74.93 E7.7
  Bottom 0.508: E14.7 C13.2 | E17.7 C16.2 86.36,25.4 140.97,25.4 142.24,26.67 E15.4 C14.2 | C31.2 C21.2 63.5,5.08 77.47,5.08 78.74,6.35 E21.4 | C7.2 E8.7 106.68,72.39 105.41,71.12 77.47,71.12 | C11.2 E12.7 | C15.2 E16.4 | E13.8 C12.2 | E13.15 63.5,59.69 64.77,60.96 74.93,60.96 76.2,59.69 E13.10 | C8.2 E9.8 78.74,72.39 77.47,71.12 | C9.2 E9.1 60.96,72.39 62.23,71.12 77.47,71.12 | E6.7 C5.2 | E6.12 38.1,105.41 39.37,106.68 41.91,106.68 43.18,105.41 E6.10 | E3.1 30.48,115.57 34.29,119.38 41.91,119.38 41.91,124.46 46.99,124.46 48.26,123.19 E3.9 | 60.96,114.3 E3.8 | 60.96,114.3 R9.1 | R17.1 60.96,114.3 | E7.7 C6.2 165.1,73.66 166.37,74.93 | 166.37,74.93 C26.2 | v194.31,80.01 189.23,74.93 166.37,74.93 | E11.7 C10.2 199.39,50.8 200.66,52.07 AB03.BC2 | C18.2 E19.4 | C22.- 200.66,121.92 AB03.AC2 | 109.22,102.87 110.49,104.14 C4.2 119.38,101.6 128.27,101.6 129.54,102.87 | 109.22,102.87 104.14,97.79 E5.4 | 109.22,102.87 105.41,106.68 92.71,106.68 90.17,109.22 D1.A | C3.2 149.86,101.6 C24.+ | 129.54,102.87 132.08,102.87 E4.12 | E4.10 137.16,102.87 139.7,102.87 E4.9 | 129.54,102.87 E4.13
N$1  (via drill 0.61)
  Top 0.508: v97.79,110.49 97.79,99.06 96.52,97.79 E5.1 | v138.43,111.76 139.7,113.03 139.7,115.57 E1.6
  Bottom 0.508: v97.79,110.49 99.06,111.76 v138.43,111.76
N$2  (via drill 0.61)
  Top 0.508: v100.33,120.65 100.33,99.06 101.6,97.79 E5.3 | C26.1 148.59,87.63 v148.59,114.3 | v111.76,114.3 110.49,115.57 110.49,120.65 Q1.E
  Bottom 0.508: R14.1 72.39,120.65 v100.33,120.65 109.22,120.65 Q1.E | v148.59,114.3 v111.76,114.3
N$3  (via drill 0.61)
  Top 0.508: R15.1 77.47,120.65 v77.47,118.11
  Bottom 0.508: v77.47,118.11 93.98,118.11 95.25,119.38 Q1.B1
N$4  (via drill 0.61)
  Top 0.508: v109.22,93.98 113.03,97.79 113.03,120.65 Q1.B2
  Bottom 0.508: R16.2 83.82,93.98 v109.22,93.98
N$5  (via drill 0.61)
  Top 0.508: R17.2 76.2,111.76 v76.2,100.33 | C30.2 106.68,124.46 v106.68,102.87
  Bottom 0.508: C30.2 119.38,121.92 128.27,121.92 129.54,123.19 E1.13 | v76.2,100.33 87.63,100.33 R16.1 102.87,99.06 v106.68,102.87
N$6  (via drill 0.61)
  Top 0.508: v118.11,120.65 116.84,119.38 C30.1 | E22.1 40.64,8.89 30.48,19.05 30.48,110.49 33.02,113.03 E3.2
  Bottom 0.508: E1.12 132.08,123.19 130.81,121.92 129.54,121.92 128.27,120.65 v118.11,120.65 115.57,123.19 106.68,123.19 105.41,121.92 97.79,121.92 97.79,127 91.44,127 87.63,123.19 53.34,123.19 49.53,119.38 44.45,119.38 | 44.45,119.38 41.91,116.84 34.29,116.84 33.02,115.57 E3.2 | 44.45,119.38 45.72,120.65 E3.10
N$7
  Bottom 0.508: E17.1 63.5,26.67 64.77,25.4 74.93,25.4 76.2,26.67 E17.6
N$8
  Top 0.508: E21.1 71.12,8.89 72.39,10.16 72.39,25.4 71.12,26.67 E17.4
  Bottom 0.508: E17.3 68.58,26.67 71.12,26.67 E17.4
N$9
  Top 0.508: R2.1 36.83,127 33.02,123.19 E3.15
  Bottom 0.508: C27.1 22.86,119.38 31.75,119.38 33.02,120.65 E3.15
N$10
  Bottom 0.508: C27.2 17.78,114.3 17.78,123.19 19.05,124.46 34.29,124.46 35.56,123.19 E3.14
N$11
  Top 0.508: R12.1 45.72,113.03 E3.7
  Bottom 0.508: C28.1 24.13,123.19 19.05,123.19 19.05,115.57 21.59,115.57 26.67,110.49 44.45,110.49 R12.1
N$12
  Bottom 0.508: C28.2 27.94,111.76 41.91,111.76 43.18,113.03 E3.6
N$13
  Top 0.508: E15.7 137.16,36.83 139.7,39.37 139.7,49.53 E11.6
N$14
  Top 0.508: E15.6 139.7,36.83 140.97,38.1 140.97,55.88 142.24,57.15 E11.8
N$15  (via drill 0.61)
  Top 0.508: v132.08,30.48 132.08,49.53 E11.3
  Bottom 0.508: v132.08,30.48 135.89,30.48 137.16,29.21 E15.2
N$16
  Top 0.508: E15.1 134.62,29.21 135.89,30.48 135.89,55.88 134.62,57.15 E11.11
N$17
  Top 0.508: E16.6 104.14,36.83 105.41,38.1 105.41,55.88 106.68,57.15 E12.8
N$18
  Top 0.508: E16.7 101.6,36.83 104.14,39.37 104.14,49.53 E12.6
N$19
  Top 0.508: E16.1 99.06,29.21 100.33,30.48 100.33,55.88 99.06,57.15 E12.11
N$20  (via drill 0.61)
  Top 0.508: v96.52,30.48 96.52,49.53 E12.3
  Bottom 0.508: v96.52,30.48 100.33,30.48 101.6,29.21 E16.2
N$21
  Top 0.508: E19.7 137.16,16.51 143.51,22.86 143.51,68.58 139.7,72.39 E7.6
N$22
  Top 0.508: E19.2 137.16,6.35 135.89,5.08 130.81,5.08 130.81,64.77 132.08,66.04 132.08,72.39 E7.3
N$23
  Top 0.508: E20.7 101.6,16.51 107.95,22.86 107.95,68.58 104.14,72.39 E8.6
N$24  (via drill 0.61)
  Top 0.508: v87.63,59.69 87.63,5.08 100.33,5.08 101.6,6.35 E20.2 | v93.98,63.5 95.25,64.77 95.25,71.12 96.52,72.39 E8.3
  Bottom 0.508: v87.63,59.69 91.44,63.5 v93.98,63.5
N$25
  Top 0.508: E20.1 99.06,8.89 97.79,10.16 97.79,78.74 99.06,80.01 E8.11
N$26
  Top 0.508: E20.6 104.14,16.51 109.22,21.59 109.22,77.47 106.68,80.01 E8.8
N$27
  Top 0.508: E19.1 134.62,8.89 133.35,10.16 133.35,78.74 134.62,80.01 E7.11
N$28
  Top 0.508: E19.6 139.7,16.51 144.78,21.59 144.78,77.47 142.24,80.01 E7.8
N$29  (via drill 0.61)
  Top 0.508: v45.72,45.72 45.72,49.53 E14.6 | v69.85,45.72 71.12,46.99 71.12,49.53 E13.5
  Bottom 0.508: v45.72,45.72 v69.85,45.72
N$30
  Top 0.508: E13.13 68.58,59.69 68.58,72.39 E9.4
N$31
  Top 0.508: E13.12 71.12,59.69 71.12,72.39 E9.5
N$32  (via drill 0.61)
  Top 0.508: v52.07,49.53 52.07,53.34 48.26,57.15 E14.8
  Bottom 0.508: v52.07,49.53 53.34,48.26 67.31,48.26 68.58,49.53 E13.4
N$33
  Top 0.508: E13.11 73.66,59.69 73.66,69.85 72.39,71.12 72.39,78.74 73.66,80.01 E9.11 73.66,82.55 73.66,83.82 77.47,83.82 77.47,78.74 81.28,74.93 81.28,49.53 78.74,46.99 78.74,36.83 E17.8
N$34
  Top 0.508: E9.14 66.04,80.01 67.31,78.74 67.31,60.96 66.04,59.69 E13.14
  Bottom 0.508: E14.12 38.1,57.15 39.37,55.88 64.77,55.88 66.04,57.15 E13.14
N$35  (via drill 0.61)
  Top 0.508: v95.25,121.92 99.06,118.11 E2.2 | C29.1 77.47,96.52 77.47,105.41 80.01,107.95 86.36,107.95 86.36,119.38 R3.1
  Bottom 0.508: R3.1 v95.25,121.92
N$36
  Top 0.508: R10.2 R3.2 R13.1
  Bottom 0.508: R13.1 80.01,128.27 101.6,128.27 101.6,125.73 E2.6
N$37
  Top 0.508: R9.2 R10.1
  Bottom 0.508: R9.2 100.33,114.3 101.6,115.57 E2.3
N$38  (via drill 0.61)
  Top 0.508: 90.17,125.73 R13.2 | 90.17,125.73 91.44,124.46 91.44,92.71 101.6,92.71 102.87,93.98 102.87,101.6 104.14,102.87 E5.5 104.14,105.41 v104.14,114.3 | 90.17,125.73 80.01,115.57 80.01,109.22 D1.C
  Bottom 0.508: v104.14,114.3 105.41,114.3 106.68,115.57 127,115.57 E1.1
N$39
  Top 0.508: E1.2 129.54,115.57 128.27,114.3 128.27,100.33 129.54,99.06 129.54,97.79 E4.2
  Bottom 0.508: E10.2 35.56,74.93 31.75,78.74 31.75,90.17 124.46,90.17 129.54,95.25 E4.2
N$40  (via drill 0.61)
  Top 0.508: v36.83,91.44 36.83,99.06 39.37,101.6 39.37,111.76 38.1,113.03 E3.4
  Bottom 0.508: v36.83,91.44 123.19,91.44 127,95.25 E4.1
N$41
  Bottom 0.508: D2.C 184.15,58.42 186.69,55.88 191.77,55.88 D3.A
N$42
  Bottom 0.508: D3.C 184.15,55.88 186.69,53.34 191.77,53.34 D4.A
N$43  (via drill 0.61)
  Top 0.508: E18.11 40.64,34.29 38.1,34.29 E18.12 | v115.57,119.38 114.3,118.11 v114.3,31.75
  Bottom 0.508: E18.13 35.56,34.29 38.1,34.29 E18.12 | 43.18,34.29 40.64,34.29 E18.11 | 43.18,34.29 E18.10 43.18,34.29 | v115.57,119.38 128.27,119.38 129.54,120.65 139.7,120.65 142.24,123.19 E1.8 | v114.3,31.75 45.72,31.75 43.18,34.29
N$44
  Top 0.508: E5.6 101.6,105.41 102.87,106.68 102.87,127 104.14,128.27 138.43,128.27 138.43,121.92 134.62,118.11 E1.4
N$45
  Bottom 0.508: E10.13 35.56,80.01 36.83,78.74 46.99,78.74 48.26,80.01 E10.8
N$46
  Top 0.508: E18.3 38.1,26.67 36.83,25.4 31.75,25.4 31.75,71.12 33.02,72.39 E10.1
  Bottom 0.508: 16.51,101.6 16.51,74.93 33.02,74.93 E10.1 | 16.51,101.6 16.51,123.19 19.05,125.73 38.1,125.73 40.64,123.19 E3.12 | 16.51,101.6 97.79,101.6 99.06,102.87 E5.7
N$47  (via drill 0.61)
  Top 0.508: E14.3 38.1,52.07 40.64,54.61 40.64,57.15 E14.11 40.64,59.69 40.64,60.96 v35.56,66.04
  Bottom 0.508: v35.56,66.04 36.83,66.04 36.83,76.2 35.56,77.47 34.29,77.47 34.29,83.82 39.37,88.9 125.73,88.9 132.08,95.25 E4.3
N$48  (via drill 0.61)
  Top 0.508: v95.25,77.47 95.25,83.82 105.41,93.98 105.41,127 133.35,127 134.62,125.73 E1.11
  Bottom 0.508: 44.45,83.82 39.37,83.82 38.1,82.55 E10.12 | 44.45,83.82 45.72,82.55 E10.9 | v95.25,77.47 93.98,78.74 53.34,78.74 49.53,82.55 49.53,83.82 44.45,83.82
N$49
  Bottom 0.508: E14.2 35.56,49.53 35.56,38.1 69.85,38.1 71.12,36.83 E17.11
N$50  (via drill 0.61)
  Top 0.508: v123.19,43.18 123.19,58.42 130.81,66.04 130.81,119.38 133.35,119.38 137.16,123.19 E1.10
  Bottom 0.508: E17.12 68.58,34.29 69.85,33.02 72.39,33.02 73.66,34.29 E17.10 73.66,36.83 77.47,40.64 120.65,40.64 v123.19,43.18
NEG1_DETECT_L
  Top 0.508: E10.6 45.72,74.93 43.18,77.47 43.18,80.01 E10.10
OSC_L  (via drill 0.61)
  Top 0.508: v187.96,48.26 R5.1
  Bottom 0.508: R5.1 194.31,41.91 200.66,41.91 AB03.BF2 | v187.96,48.26 140.97,48.26 140.97,53.34 139.7,54.61 38.1,54.61 35.56,57.15 E14.13
RANDOM_L  (via drill 0.61)
  Top 0.508: v139.7,85.09 139.7,92.71 138.43,93.98 138.43,109.22 132.08,115.57 E1.3
  Bottom 0.508: AB03.AR2 200.66,86.36 R4.1 191.77,85.09 v139.7,85.09
REV_L  (via drill 0.61)
  Top 0.508: R6.1 198.12,116.84 199.39,115.57 200.66,115.57 AB03.AE1 | E17.13 66.04,36.83 v55.88,46.99 55.88,106.68 v59.69,110.49
  Bottom 0.508: v55.88,46.99 45.72,46.99 43.18,49.53 E14.5 | R6.1 190.5,114.3 158.75,114.3 153.67,109.22 92.71,109.22 91.44,110.49 v59.69,110.49
RTZ_L  (via drill 0.61)
  Top 0.508: AB03.AB1 200.66,124.46 R1.1 184.15,115.57 184.15,60.96 185.42,59.69 v185.42,29.21 | E17.2 66.04,26.67 62.23,22.86 62.23,13.97 53.34,5.08 41.91,5.08 41.91,12.7 43.18,13.97 E22.7
  Bottom 0.508: 34.29,24.13 34.29,49.53 33.02,49.53 E14.1 | 34.29,24.13 34.29,17.78 39.37,12.7 41.91,12.7 43.18,13.97 E22.7 | v185.42,29.21 180.34,24.13 34.29,24.13
RUN_L  (via drill 0.61)
  Top 0.508: E5.2 99.06,95.25 99.06,93.98 95.25,93.98 93.98,95.25 93.98,101.6 v92.71,102.87 93.98,104.14 93.98,130.81 196.85,130.81 196.85,128.27 200.66,128.27 AB03.AA1
  Bottom 0.508: R11.1 90.17,102.87 v92.71,102.87
SEEK_INCOMPLETE_L  (via drill 0.61)
  Top 0.508: v81.28,41.91 81.28,13.97 76.2,8.89 E21.3
  Bottom 0.508: v81.28,41.91 83.82,44.45 199.39,44.45 200.66,45.72 AB03.BE2
STEP_L  (via drill 0.61)
  Top 0.508: v185.42,66.04 190.5,71.12 190.5,104.14 R8.1
  Bottom 0.508: v185.42,66.04 134.62,66.04 133.35,64.77 29.21,64.77 29.21,33.02 33.02,29.21 E18.1 | R8.1 195.58,109.22 201.93,109.22 AB03.AH2
VCC
  Top 0.508: R2.2 E3.16 30.48,120.65 34.29,116.84 34.29,106.68 | 34.29,106.68 35.56,107.95 R12.2 | 34.29,106.68 33.02,105.41 E6.14 33.02,102.87 34.29,101.6 34.29,78.74 | 34.29,55.88 34.29,38.1 33.02,36.83 E18.14 | 34.29,55.88 33.02,57.15 E14.14 | 34.29,78.74 33.02,80.01 E10.14 | 34.29,78.74 34.29,55.88 | C2.1 52.07,123.19 52.07,105.41 | C5.1 52.07,105.41 | 52.07,105.41 52.07,82.55 C9.1 54.61,80.01 54.61,57.15 | 54.61,35.56 C17.1 | 54.61,35.56 E17.14 63.5,34.29 60.96,31.75 C21.1 | 54.61,57.15 C13.1 | 54.61,57.15 54.61,35.56 | R5.2 180.34,45.72 180.34,71.12 R25.1 R24.1 R23.1 R22.1 R4.2 R21.1 R20.1 R19.1 R18.1 R8.2 R27.2 R26.2 R6.2 R7.2 R1.2 | E12.14 91.44,59.69 90.17,60.96 90.17,78.74 91.44,80.01 E8.14 91.44,91.44 R11.2 | C12.1 82.55,57.15 82.55,36.83 C16.1 | E7.14 C7.1 | 115.57,59.69 C11.1 | 115.57,59.69 115.57,80.01 C7.1 | E1.14 127,123.19 125.73,121.92 125.73,111.76 127,110.49 E4.14 127,102.87 116.84,102.87 C4.1 C7.1 | C3.1 C6.1 148.59,80.01 148.59,58.42 | 148.59,36.83 152.4,40.64 C25.+ 148.59,58.42 | 148.59,36.83 C14.1 | 148.59,58.42 C10.1 | C18.1 148.59,16.51 148.59,36.83 | C15.1 115.57,36.83 115.57,59.69
  Bottom 0.508: C9.1 E9.16 | R11.2 80.01,105.41 | 80.01,105.41 96.52,105.41 E5.8 | 80.01,105.41 54.61,105.41 C5.1 49.53,107.95 36.83,107.95 R12.2 | C13.1 E13.16 | E20.8 C20.1 81.28,17.78 58.42,17.78 | 58.42,17.78 41.91,17.78 40.64,16.51 E22.8 | 58.42,17.78 C21.1 E21.8 | C1.1 149.86,121.92 C22.+ 153.67,121.92 156.21,124.46 R1.2 186.69,128.27 201.93,128.27 AB03.AA2 | C12.1 E12.14 | E8.14 C8.1 | C16.1 E16.8 99.06,36.83 100.33,38.1 114.3,38.1 C15.1 E15.8 | C11.1 E11.14 | AB03.BA2 200.66,58.42 D2.A 191.77,58.42 189.23,60.96 156.21,60.96 153.67,58.42 C25.+ | C19.1 E19.8 134.62,16.51 135.89,17.78 144.78,17.78 C18.1 | E7.14 127,82.55 128.27,83.82 144.78,83.82 C6.1 R23.1

### Text on the board
Top: G503 Positioner | VRS
Bottom: G503 Positioner | VRS